# Altium schematic sheet SIM900.SchDoc
size A4
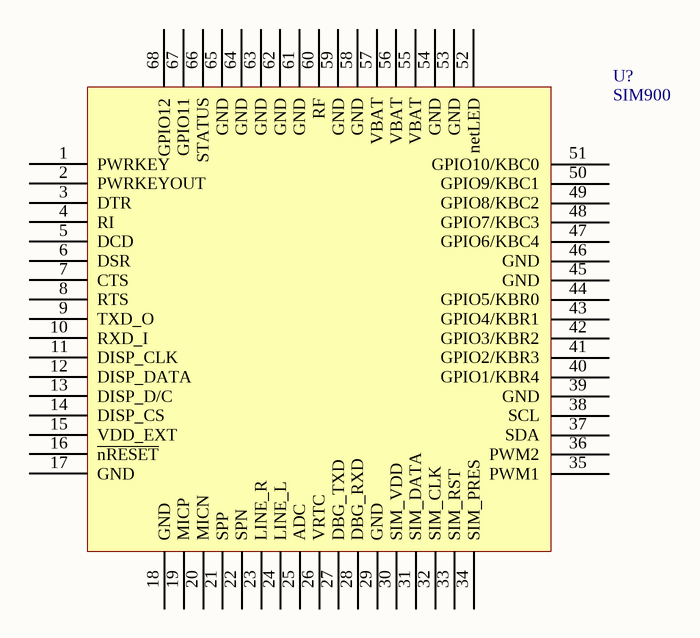
[diagram p0: SIM900.SchDoc]

## Parts
U?  SIM900  [GSM_900A]

## Nets

Not connected (* = marked no-connect by the designer): U? 1(PWRKEY) 2(PWRKEYOUT) 3(DTR) 4(RI) 5(DCD) 6(DSR) 7(CTS) 8(RTS) 9(TXD_O) 10(RXD_I) 11(DISP_CLK) 12(DISP_DATA) 13(DISP_D/C) 14(DISP_CS) 15(VDD_EXT) 16(~{nRESET}) 17(GND) 18(GND) 19(MICP) 20(MICN) 21(SPP) 22(SPN) 23(LINE_R) 24(LINE_L) 25(ADC) 26(VRTC) 27(DBG_TXD) 28(DBG_RXD) 29(GND) 30(SIM_VDD) 31(SIM_DATA) 32(SIM_CLK) 33(SIM_RST) 34(SIM_PRES) 35(PWM1) 36(PWM2) 37(SDA) 38(SCL) 39(GND) 40(GPIO1/KBR4) 41(GPIO2/KBR3) 42(GPIO3/KBR2) 43(GPIO4/KBR1) 44(GPIO5/KBR0) 45(GND) 46(GND) 47(GPIO6/KBC4) 48(GPIO7/KBC3) 49(GPIO8/KBC2) 50(GPIO9/KBC1) 51(GPIO10/KBC0) 52(netLED) 53(GND) 54(GND) 55(VBAT) 56(VBAT) 57(VBAT) 58(GND) 59(GND) 60(RF) 61(GND) 62(GND) 63(GND) 64(GND) 65(GND) 66(STATUS) 67(GPIO11) 68(GPIO12)